# EAGLE design MotorController (EAGLE 9.1.3)
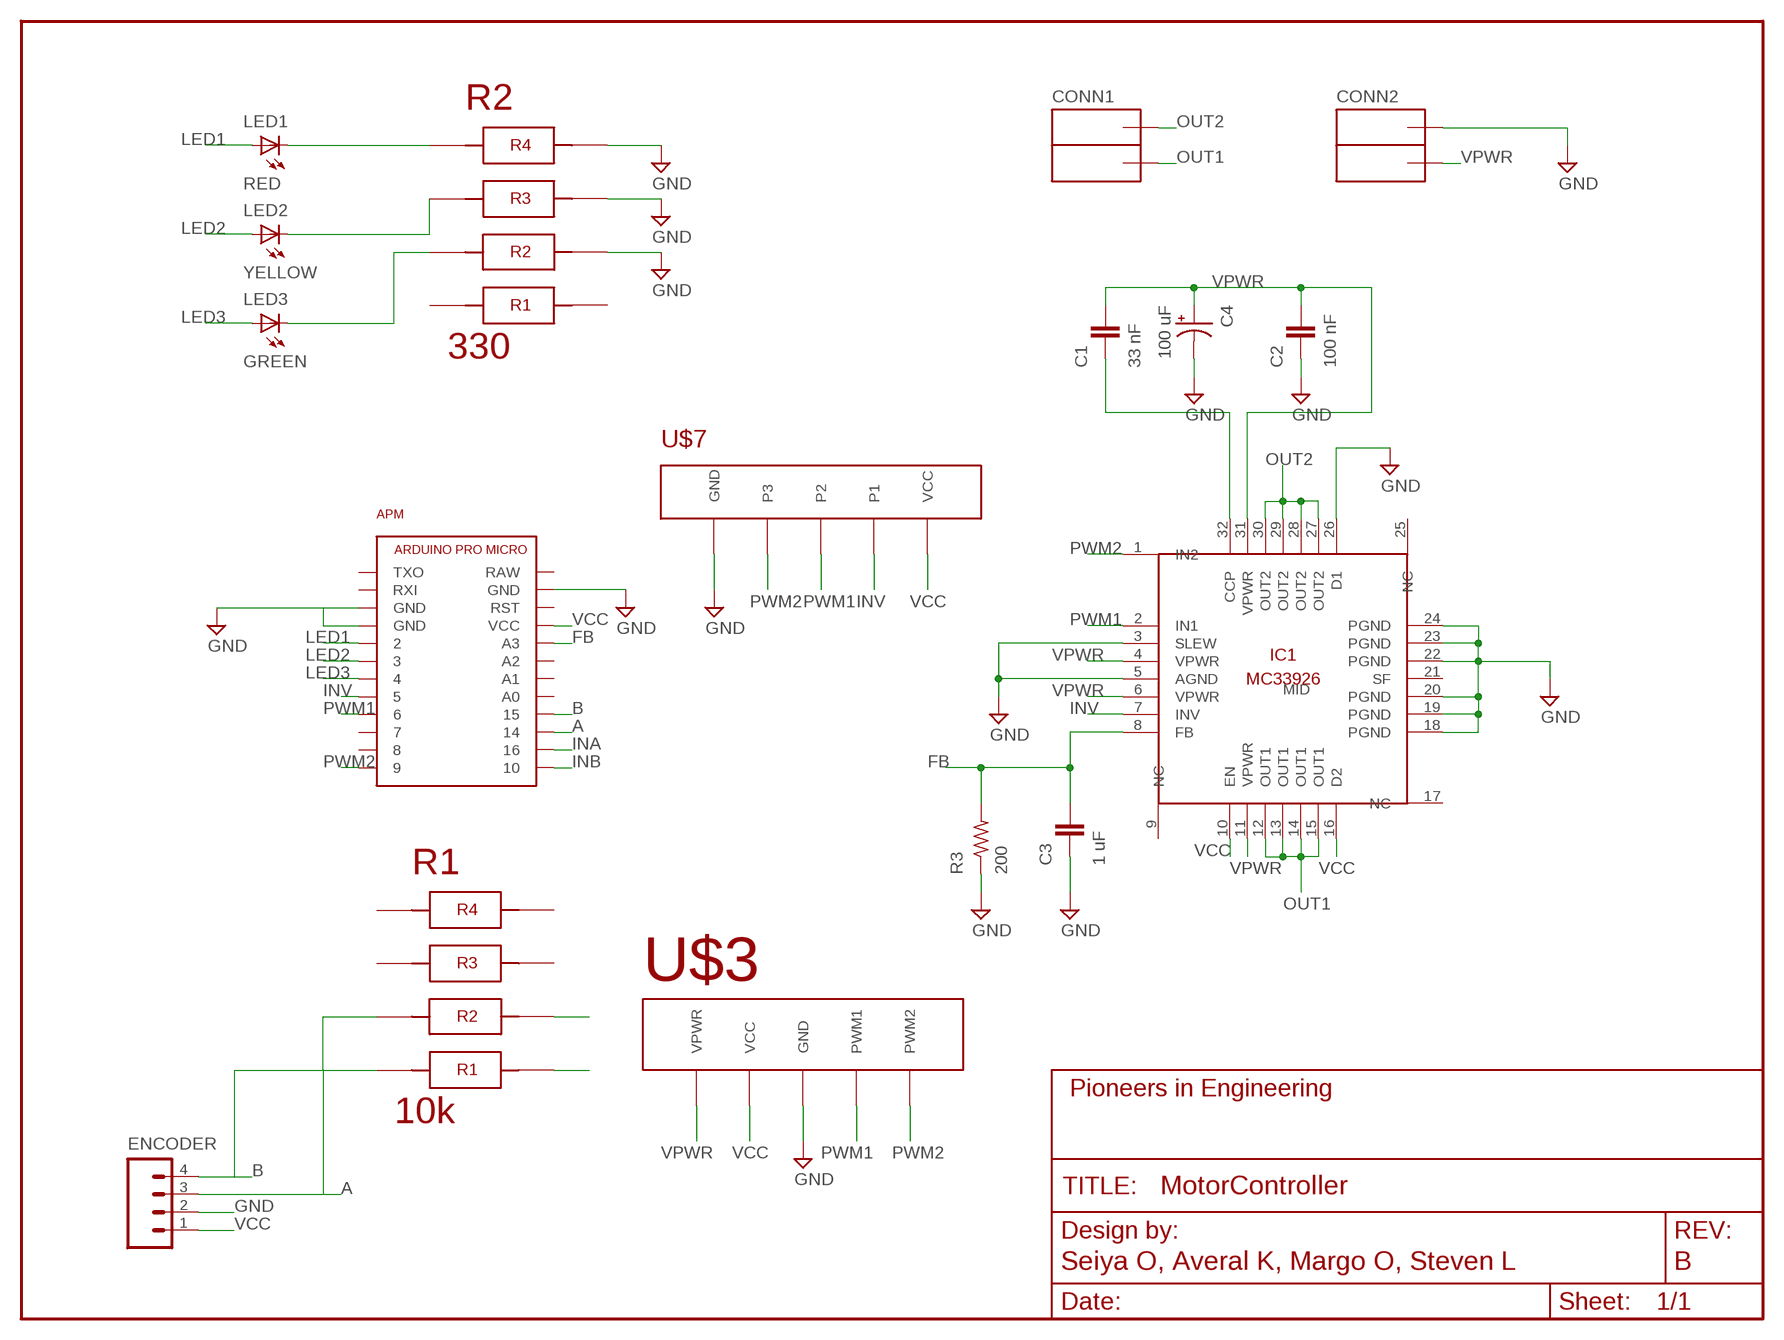
[diagram p0: schematic, sheet 1]
FRAME1 (FRAME_SCHEMATIC): AUTHOR: Seiya O, Averal K, Margo O, Steven L; REVISION: B

## Parts
APM  ARDUINO_PRO_MICRO  [ARDUINO_PRO_MICRO]
C1  33 nF  CAP0603-CAP  [0603-CAP]
C2  100 nF  CAP0603-CAP  [0603-CAP]
C3  1 uF  CAP0603-CAP  [0603-CAP]
C4  100 uF  CAP_POLRADIAL  [.248"CAP_THRU]
CONN1  ANDERSONVERTICAL  [ANDERSON_VERTICAL]
CONN2  ANDERSONVERTICAL  [ANDERSON_VERTICAL]
ENCODER  M041X04-MTA  [1X04-MTA]
IC1  MC33926  [PQFN-32]
LED1  RED  LED1206  [LED-1206]
LED2  YELLOW  LED1206  [LED-1206]
LED3  GREEN  LED1206  [LED-1206]
R1  10k  4X-0603  [4X-0603]
R2  330  4X-0603  [4X-0603]
R3  200  R-US_R0603  [R0603]
U$3  5XPOGO  [5XPOGO.40"]
U$7  5PIN5PIN_MC  [5PIN_MC]

## Nets
A: APM.14 ENCODER.3 R1.7
B: APM.15 ENCODER.4 R1.8
CCP: C1.1 IC1.32(CCP)
FB: APM.A3 C3.2 IC1.8(FB) R3.2
GND: APM.GND@0(GND) APM.GND@1(GND) APM.GND@2(GND) C2.1 C3.1 C4.MINUS(-) CONN2.PIN2(OUTA) ENCODER.2 IC1.3(SLEW) IC1.5(AGND) IC1.18(PGND) IC1.19(PGND) IC1.20(PGND) IC1.22(PGND) IC1.23(PGND) IC1.24(PGND) IC1.26(D1) R2.2 R2.3 R2.4 R3.1 U$3.GND U$7.GND
INA: APM.16
INB: APM.10
INV: APM.5 IC1.7(INV) U$7.INV(P1)
LED1: APM.2 LED1.A
LED2: APM.3 LED2.A
LED3: APM.4 LED3.A
N$1: LED2.C R2.6
N$2: LED1.C R2.5
N$6: LED3.C R2.7
OUT1: CONN1.PIN1(OUTB) IC1.12(OUT1) IC1.13(OUT1) IC1.14(OUT1) IC1.15(OUT1)
OUT2: CONN1.PIN2(OUTA) IC1.27(OUT2) IC1.28(OUT2) IC1.29(OUT2) IC1.30(OUT2)
PWM1: APM.6 IC1.2(IN1) U$3.PWM1 U$7.PWM1(P2)
PWM2: APM.9 IC1.1(IN2) U$3.PWM2 U$7.PWM2(P3)
VCC: APM.VCC ENCODER.1 IC1.10(EN) IC1.16(D2) R1.1 R1.2 U$3.VCC U$7.VCC
VPWR: C1.2 C2.2 C4.PLUS(+) CONN2.PIN1(OUTB) IC1.4(VPWR) IC1.6(VPWR) IC1.11(VPWR) IC1.31(VPWR) U$3.VPWR
Unconnected: APM.7 APM.8 APM.A0 APM.A1 APM.A2 APM.RAW APM.RST APM.RXI APM.TXO IC1.9(NC) IC1.17(NC) IC1.21(SF) IC1.25(NC) IC1.MID(AGND) R1.3 R1.4 R1.5 R1.6 R2.1 R2.8

## Library data of the parts
APM = pie:ARDUINO_PRO_MICRO: Arduino Pro Micro Electrical System Year 9's Smart Sensor Core Pin Outs <https://cdn.sparkfun.com/assets/9/c/3/c/4/523a1765757b7f5c6e8b4567.png> Buy Here <http://www.aliexpress.com/item/Mini-Leonardo-Pro-Micro-ATmega32U4-5V-16MHz-Module-For-Arduino-Best-Quality/32284746884.html?ws_ab_test=searchweb201556_8,searchweb201602_2_10057_10056_10065_10055_10054_10067_10069_10059_10058_10017_10070_10060_10061_10052_10062_10053_10050_10051,searchweb201603_1&btsid=45993952-29ca-4de4-a0fb-c7fb72b8e1a5> Thru Hole Female Pins <http://www.digikey.com/product-search/en?keywords=929974E-01-12-ND> Surface Mount Female Pins <http://www.digikey.com/product-detail/en/sullins-connector-solutions/NPTC121KFXC-RC/S5604-ND/776062>; DESCRIPTION: Arduino Pro Micro; DISTRIBUTOR: AliExpress; DISTRIBUTOR_PART_NUMBER: 32284746884; MANUFACTURER: Feiyang electronics; NOTES: https://www.aliexpress.com/item/Mini-Leonardo-Pro-Micro-ATmega32U4-5V-16MHz-Module-For-Arduino-Best-Quality/32284746884.html?ws_ab_test=searchweb201556_8,searchweb201602_2_10057_10056_10065_10055_10054_10067_10069_10059_10058_10017_10070_10060_10061_10052_10062_10053_10050_10051,searchweb201603_1&btsid=45993952-29ca-4de4-a0fb-c7fb72b8e1a5; PACKAGE: ARDUINO_PRO_MICRO; REFERENCE_DEST: ARDUINO_PRO_MICRO
C1-C3 = pie:CAP: Capacitor Standard 0603 ceramic capacitor, and 0.1" leaded capacitor.; PIE-INT-REF-NUM: CAPACITOR-GENERIC
C4 = pie:CAP_POL: Capacitor Polarized These are standard SMD and PTH capacitors. Normally 10uF, 47uF, and 100uF in electrolytic and tantalum varieties. Always verify the external diameter of the through hole cap, it varies with capacity, voltage, and manufacturer. The EIA devices should be standard.
CONN1 CONN2 = pie:ANDERSON: 2-pin 25A Anderson Connector http://www.alliedelec.com/images/products/datasheets/bm/ANDERSON_POWER_PRODUCTS/70162018.pdf; PIE-INT-REF-NUM: Anderson
ENCODER = pie:M04: 4-pin 0.1-inch header and MTA connector; PIE-INT-REF-NUM: MTA
IC1 = pie:MC33926: https://www.nxp.com/docs/en/data-sheet/MC33926.pdf
LED1-LED3 = pie:LED: LEDs Standard schematic elements and footprints for 5mm, 3mm, 1206, and 0603 sized LEDs. 5mm - Spark Fun Electronics SKU : COM-00529 (and others); PIE-INT-REF-NUM: LED
R1 R2 = pie:4X-0603: 330: https://www.digikey.com/product-detail/en/panasonic-electronic-components/EXB-38V331JV/Y9331CT-ND/256586 10k: https://www.digikey.com/product-detail/en/panasonic-electronic-components/EXB-38V103JV/Y9103CT-ND/256604
R3 = pie:R-US_: RESISTOR, American symbol; DESCRIPTION: RESISTOR, American symbol; DISTRIBUTOR: DigiKey; MANUFACTURER: Rohm Semiconductor; NOTES: Cut Tape; PACKAGE: R0603; VALUE: >VALUE
U$3 = pie:5XPOGO
U$7 = pie:5PIN

## Board
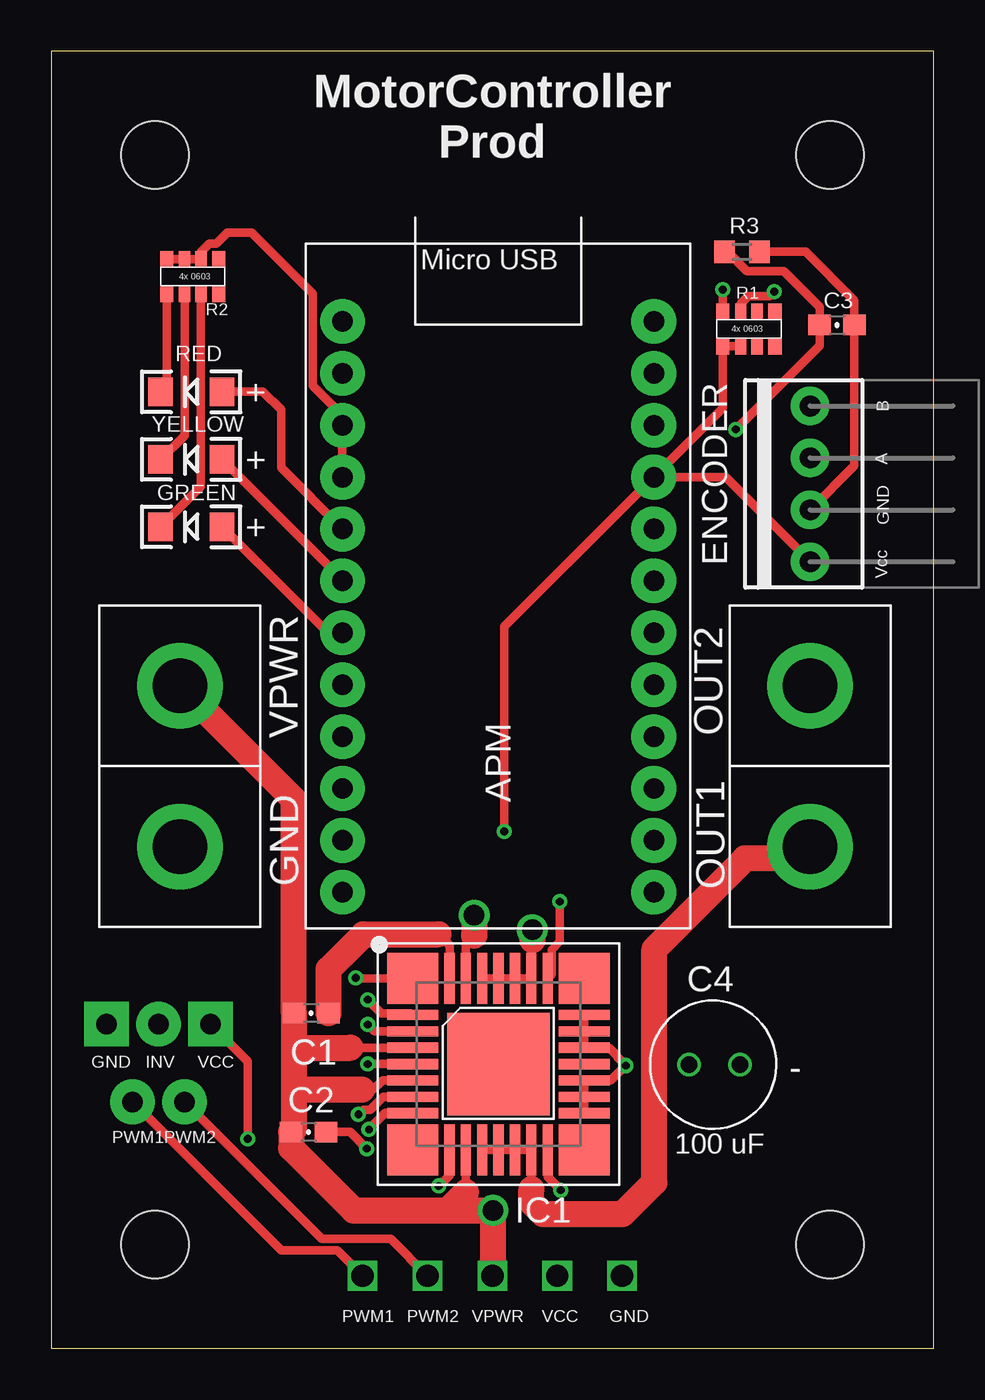
[diagram p1: board, top side]
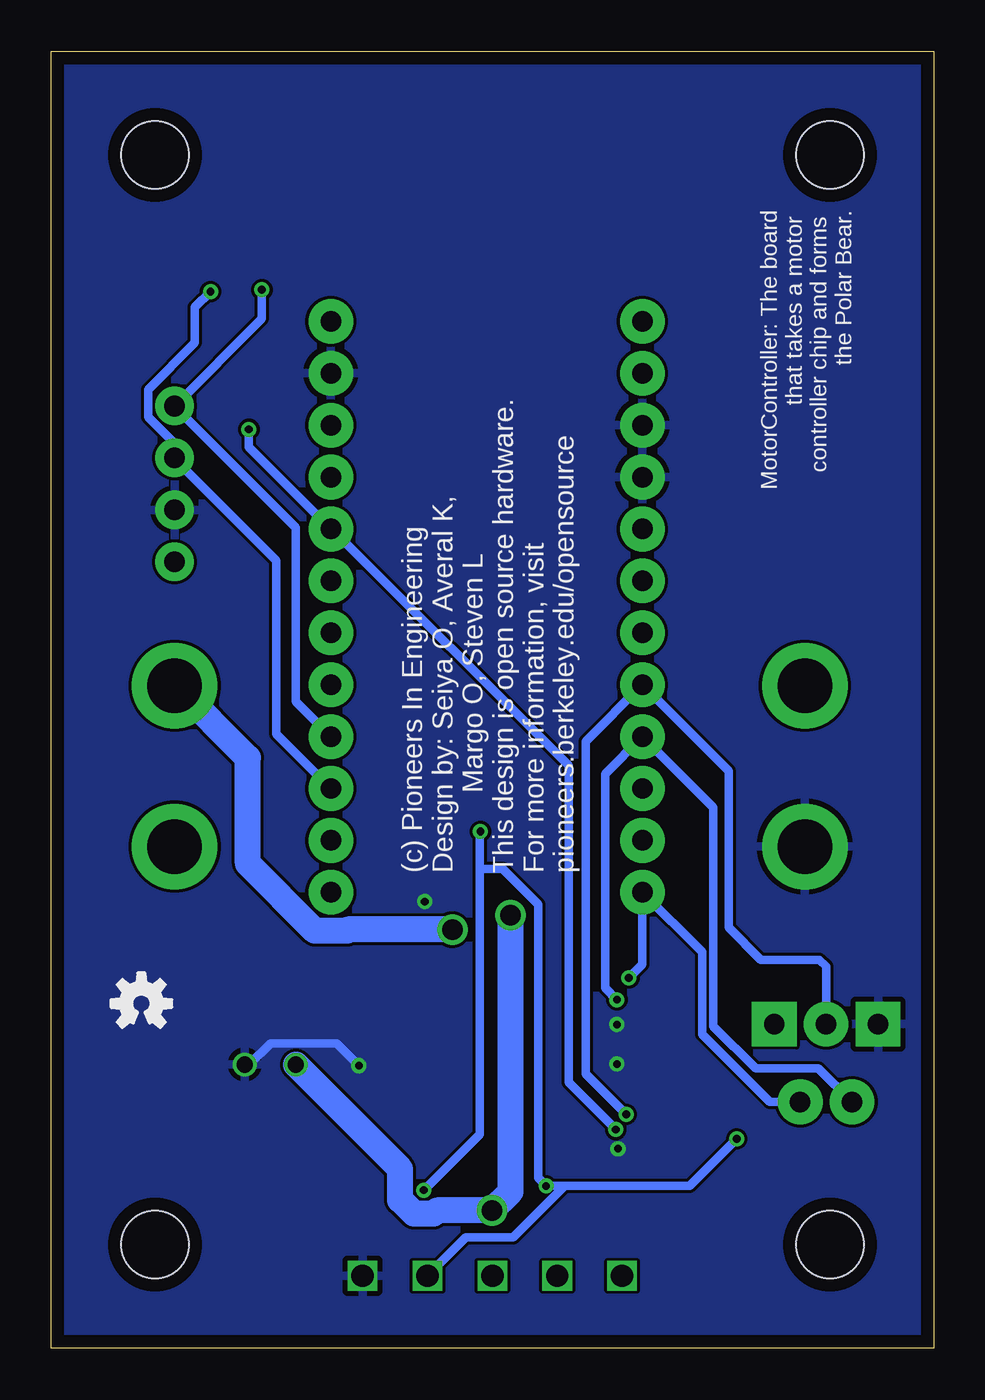
[diagram p2: board, bottom side, seen from below]

Size 43.18 x 63.5 mm. Coordinates in mm from the lower left corner, seen from the top.
Outline: 0,0 43.18,0 43.18,63.5 0,63.5 0,0
Copper layers (1*16): Top 2mil / dielectric 9mil / Bottom 2mil
Design rules "pie": minimum track width 6mil, minimum drill 15mil, track to track 6mil, track to pad 6mil, pad to pad 6mil, via to via 6mil, smd to smd 6mil, copper to edge 25mil, drill to drill 7mil, minimum pad ring 7mil, minimum via ring 7mil, stop-mask expansion 3mil, vias tented up to drill 21mil, thermal gap 10mil

### Footprints (pad centres in the part's own frame; a part is rotated, then mirrored left to right if it is on the bottom)
ARDUINO_PRO_MICRO = drill 1 pad 2.184: 2 1.778,19.558; 3 1.778,17.018; 4 1.778,14.478; 5 1.778,11.938; 6 1.778,9.398; 7 1.778,6.858; 8 1.778,4.318; 9 1.778,1.778; 10 17.018,1.778; 14 17.018,6.858; 15 17.018,9.398; 16 17.018,4.318; A0 17.018,11.938; A1 17.018,14.478; A2 17.018,17.018; A3 17.018,19.558; GND@0 1.778,24.638; GND@1 1.778,22.098; GND@2 17.018,27.178; RAW 17.018,29.718; RST 17.018,24.638; RXI 1.778,27.178; TXO 1.778,29.718; VCC 17.018,22.098
0603-CAP = smd 1.1 x 1: 1 -0.85,0; 2 0.85,0
.248"CAP_THRU = drill 0.8: MINUS 0,0; PLUS 2.5,0
ANDERSON_VERTICAL = drill 2.667 pad 4.191: PIN1 0,-3.937; PIN2 0,3.937
1X04-MTA = drill 1.016 pad 1.88: 1 -3.81,0; 2 -1.27,0; 3 1.27,0; 4 3.81,0
PQFN-32 = smd 2.5 x 2.5: 1 -4.2,4.2; 9 -4.2,-4.2; 17 4.2,-4.2; 25 4.2,4.2 | smd 2.5 x 0.5: 2 -4.2,2.4; 3 -4.2,1.6; 4 -4.2,0.8; 5 -4.2,0; 6 -4.2,-0.8; 7 -4.2,-1.6; 8 -4.2,-2.4; 18 4.2,-2.4; 19 4.2,-1.6; 20 4.2,-0.8; 21 4.2,0; 22 4.2,0.8; 23 4.2,1.6; 24 4.2,2.4 | smd 0.5 x 2.5: 10 -2.4,-4.2; 11 -1.6,-4.2; 12 -0.8,-4.2; 13 0,-4.2; 14 0.8,-4.2; 15 1.6,-4.2; 16 2.4,-4.2; 26 2.4,4.2; 27 1.6,4.2; 28 0.8,4.2; 29 0,4.2; 30 -0.8,4.2; 31 -1.6,4.2; 32 -2.4,4.2 | smd 5 x 5: MID 0,0
LED-1206 = smd 1.2 x 1.4: A -1.5,0; C 1.5,0
4X-0603 = smd 0.65 x 0.8: 1 0,-0.05; 4 2.55,-0.05; 5 2.55,1.65; 8 0,1.65 | smd 0.55 x 0.8: 2 0.875,-0.05; 3 1.675,-0.05; 6 1.675,1.65; 7 0.875,1.65
R0603 = smd 1 x 1.1: 1 -0.85,0; 2 0.85,0
STAND-OFF = hole 3.302: 0,0
5XPOGO.40" = drill 1.092 square: GND 12.7,0; PWM1 0,0; PWM2 3.175,0; VCC 9.525,0; VPWR 6.35,0
5PIN_MC = drill 1 pad 2.184 square: GND 0,0; VCC 5.08,0 | drill 1 pad 2.184: INV 2.54,0; PWM1 1.27,-3.81; PWM2 3.81,-3.81

### Placement (x,y rotation side)
APM  12.47,20.55 0 top
C1  12.73,16.41 180 top
C2  12.6,10.59 180 top
C3  38.46,50.09 180 top
C4  33.71,13.89 180 top
CONN1  37.13,28.5 0 top
CONN2  6.3,28.5 180 top
ENCODER  37.14,42.32 90 top
IC1  21.89,13.92 0 top
LED1  6.86,46.82 180 top
LED2  6.86,43.52 180 top
LED3  6.86,40.22 180 top
R1  32.87,49.1 0 top
R2  8.2,53.26 180 top
R3  33.81,53.67 180 top
U$1  [STAND-OFF]  38.1,58.42 0 top
U$2  [STAND-OFF]  38.1,5.08 0 top
U$3  15.24,3.56 0 top
U$4  [OSHW-LOGO-S]  38.77,16.88 0 bottom
U$5  [STAND-OFF]  5.08,58.42 0 top
U$6  [STAND-OFF]  5.08,5.08 0 top
U$7  2.72,15.88 0 top

### Tracks (layer width: path | path; a pad name or v marks a point on that pad's centre or on a via)
A  (via drill 0.38)
  Top 0.406: v35.38,51.73 35.16,51.5 34.12,51.5 33.74,51.13 R1.7
  Bottom 0.406: APM.14 32.16,30.07 32.16,38.56 37.14,43.54 ENCODER.3 37.14,44.29 38.44,45.59 38.44,46.94 36.14,49.23 36.14,50.96 v35.38,51.73
B  (via drill 0.38)
  Top 0.406: R1.8 v32.87,51.82
  Bottom 0.406: APM.15 31.22,31.67 31.22,40.18 37.14,46.11 ENCODER.4 32.87,50.4 v32.87,51.82
CCP
  Top 0.406: 18.95,20.27 19.5,19.72 IC1.32
  Top 1.27: C1.1 13.57,18.55 15.29,20.27 18.95,20.27
FB  (via drill 0.38)
  Top 0.406: IC1.8 16.36,11.52 v15.55,10.71 | R3.2 33.1,53.67 34.04,52.73 35.84,52.73 37.61,50.96 C3.2 37.61,49.09 v33.5,44.98
  Bottom 0.406: v15.55,10.71 17.86,13.02 17.86,28.52 29.44,40.11 APM.A3 33.5,44.12 v33.5,44.98
GND  (via drill 0.38)
  Top 0.406: APM.GND@1 APM.GND@0 14.25,45.68 12.8,47.13 12.8,51.64 9.83,54.61 8.62,54.61 8.08,54.07 7.73,54.07 7.33,53.67 R2.2 R2.3 R2.4 | IC1.5 v15.49,13.92 | IC1.18 IC1.19 IC1.20 27.39,13.12 v28.12,13.84 27.7,14.26 27.7,14.32 27.3,14.72 IC1.22 IC1.23 IC1.24 | IC1.26 24.49,18.31 24.49,19.52 24.89,19.92 v24.89,21.87 | C2.1 14.63,10.59 v15.44,9.78 | ENCODER.2 39.31,43.21 C3.1 39.31,51.3 36.93,53.67 R3.1 | IC1.3 15.82,15.52 v15.49,15.85
  Bottom 0.406: v28.12,13.84 29.21,14.94 32.44,14.94 33.48,13.89 C4.MINUS
  pour Bottom: -0.36,64.44 44.07,64.44 44.07,-0.25 -0.36,-0.25
INV  (via drill 0.38)
  Top 0.406: v15.04,11.46 15.27,11.68 15.62,11.68 16.26,12.32 IC1.7
  Bottom 0.406: v15.04,11.46 17.02,13.44 17.02,29.72 APM.5 10.03,28.27 10.03,20.6 8.46,19.02 5.59,19.02 5.26,18.69 U$7.INV
LED1
  Top 0.406: APM.2 11.25,43.1 11.25,45.95 10.36,46.84 10.35,46.82 LED1.A
LED2
  Top 0.406: LED2.A 14.25,37.63 APM.3
LED3
  Top 0.406: LED3.A 13.55,35.03 APM.4
N$1
  Top 0.406: LED2.C 6.53,44.69 R2.6
N$2
  Top 0.406: LED1.C 5.65,47.12 R2.5
N$6
  Top 0.406: LED3.C 7.33,42.19 R2.7
OUT1
  Top 0.406: IC1.12 IC1.13 IC1.14 IC1.15 23.5,7.8
  Top 1.27: 23.5,7.8 23.5,7.16 24.08,6.58 27.96,6.58 29.52,8.13 29.52,19.54 33.96,23.98 36.56,23.98 CONN1.PIN1
OUT2  (via drill 1)
  Top 0.406: IC1.30 IC1.29 IC1.28 IC1.27 23.5,19.94 23.55,19.99
  Top 1.27: 23.55,19.99 v23.55,20.5
  Bottom 1.27: v23.55,20.5 28.66,20.5 28.71,20.45 30.27,20.45 33.55,23.73 33.55,28.91 37.08,32.44 CONN1.PIN2
PWM1  (via drill 0.38)
  Top 0.406: IC1.2 17.6,16.41 16.15,16.41 v15.49,17.07 | U$3.PWM1 13.99,4.8 11.25,4.8 U$7.PWM1
  Bottom 0.406: v15.49,17.07 16.08,17.65 16.08,28.12 APM.6 10.77,26.47 10.77,15.77 8.71,13.72 5.64,13.72 U$7.PWM1
PWM2  (via drill 0.38)
  Top 0.406: IC1.1 14.93,18.12 v14.91,18.14 | U$3.PWM2 16.61,5.36 13.23,5.36 U$7.PWM2
  Bottom 0.406: v14.91,18.14 14.25,18.8 APM.9 11.33,19.41 11.33,15.37 8.03,12.06 U$7.PWM2
VCC  (via drill 0.38)
  Top 0.406: IC1.10 19.5,8.48 v18.96,7.95 | IC1.16 24.3,8.4 24.49,8.21 24.49,8.2 v24.94,7.75 | v22.17,25.3 22.17,35.33 APM.VCC | APM.VCC 33,42.65 ENCODER.1 | APM.VCC 32.87,46.02 R1.1 R1.2 | v9.63,10.26 9.63,14.05 U$7.VCC
  Bottom 0.406: v24.94,7.75 22.2,10.49 22.2,23.47 | 22.2,23.47 21.08,23.47 19.36,21.74 19.36,8.34 v18.96,7.95 18.06,7.95 | 22.2,23.47 22.2,25.27 v22.17,25.3 | 18.06,7.95 17.45,7.95 11.94,7.95 v9.63,10.26 | 18.06,7.95 20.57,5.44 22.89,5.44 U$3.VCC
VPWR  (via drill 1)
  Top 0.406: 14.66,14.72 IC1.4 | 15.21,12.68 15.77,12.68 16.22,13.12 IC1.6 | 20.3,7.64 IC1.11 | IC1.11 | 20.7,20.19 20.3,19.79 IC1.31
  Top 1.27: 11.88,14.68 C1.2 11.88,26.86 CONN2.PIN1 | 11.88,14.68 11.88,13.06 | 11.88,13.06 11.88,10.72 C2.2 11.75,9.82 14.81,6.76 19.41,6.76 | 11.88,14.68 11.91,14.72 14.66,14.72 | 11.88,13.06 12.26,12.68 15.21,12.68 | 19.41,6.76 20.3,7.64 | 19.41,6.76 v21.61,6.76 21.61,3.58 U$3.VPWR | 20.7,20.19 20.73,20.22 20.7,20.24 v20.7,21.21
  Bottom 1.27: C4.PLUS 26.1,8.79 26.1,7.27 25.42,6.59 24.46,6.59 24.3,6.76 v21.61,6.76 20.7,7.67 v20.7,21.21

### Text on the board
tPlace: MotorController / Prod | VPWR | OUT2 | GND | OUT1
tNames: B | A | GND | Vcc
bNames: MotorController: The board / that takes a motor / controller chip and forms / the Polar Bear. | (c) Pioneers In Engineering / Design by: Seiya O, Averal K, / Margo O, Steven L / This design is open source hardware. / For more information, visit / pioneers.berkeley.edu/opensource